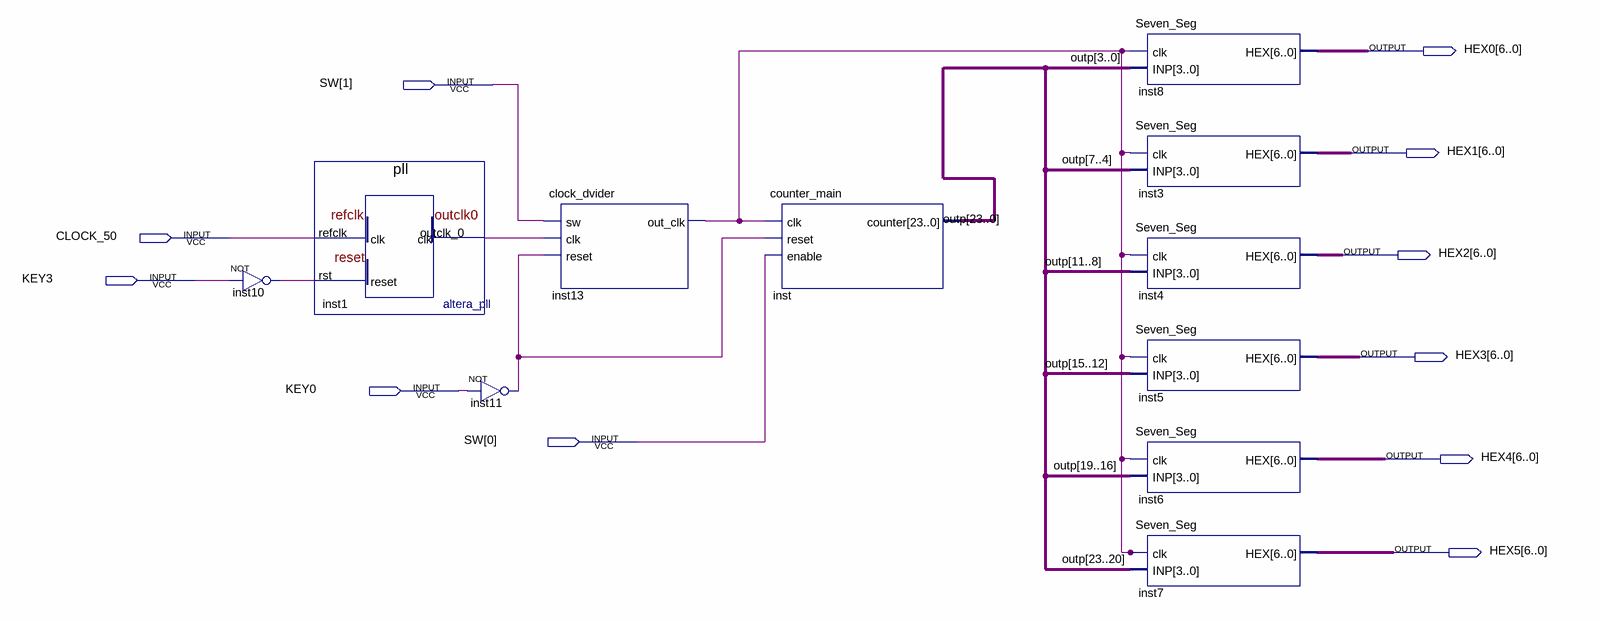
[diagram p0: schematic sheet]
// Quartus schematic project2.bdf as structural Verilog: 11 symbols, 11 pins
module project2 (
  input  [1:0] SW,
  input  CLOCK_50,
  input  KEY3,
  input  KEY0,
  output [6:0] HEX0,
  output [6:0] HEX1,
  output [6:0] HEX2,
  output [6:0] HEX3,
  output [6:0] HEX4,
  output [6:0] HEX5
);

  wire inst1_outclk_0, inst10_out, inst11_out, inst13_out_clk;
  wire [23:0] outp;

  not inst10 (inst10_out, KEY3);
  pll inst1 (.refclk(CLOCK_50), .rst(inst10_out), .outclk_0(inst1_outclk_0));
  not inst11 (inst11_out, KEY0);
  clock_dvider inst13 (.sw(SW[1]), .clk(inst1_outclk_0), .reset(inst11_out), .out_clk(inst13_out_clk));
  counter_main inst (.clk(inst13_out_clk), .reset(inst11_out), .enable(SW[0]), .counter(outp));
  Seven_Seg inst8 (.clk(inst13_out_clk), .INP(outp[3:0]), .HEX(HEX0));
  Seven_Seg inst3 (.clk(inst13_out_clk), .INP(outp[7:4]), .HEX(HEX1));
  Seven_Seg inst4 (.clk(inst13_out_clk), .INP(outp[11:8]), .HEX(HEX2));
  Seven_Seg inst5 (.clk(inst13_out_clk), .INP(outp[15:12]), .HEX(HEX3));
  Seven_Seg inst6 (.clk(inst13_out_clk), .INP(outp[19:16]), .HEX(HEX4));
  Seven_Seg inst7 (.clk(inst13_out_clk), .INP(outp[23:20]), .HEX(HEX5));
endmodule
